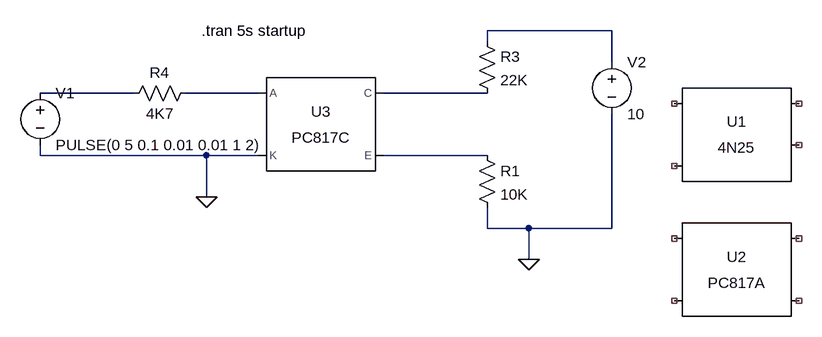
[diagram p0: schematic Draft1.asc]
Draft1.asc, the LTspice schematic file:
Version 4
SHEET 1 1096 680
WIRE 800 144 608 144
WIRE 608 160 608 144
WIRE 800 192 800 144
WIRE 64 240 -80 240
WIRE 256 240 144 240
WIRE 608 240 448 240
WIRE -80 336 -80 320
WIRE 176 336 -80 336
WIRE 256 336 176 336
WIRE 608 336 448 336
WIRE 176 400 176 336
WIRE 608 448 608 416
WIRE 672 448 608 448
WIRE 800 448 800 272
WIRE 800 448 672 448
WIRE 672 496 672 448
FLAG 176 400 0
FLAG 672 496 0
SYMBOL Optos/4N25 992 320 R0
SYMATTR InstName U1
SYMBOL voltage -80 224 R0
SYMATTR InstName V1
SYMATTR Value PULSE(0 5 0.1 0.01 0.01 1 2)
SYMBOL voltage 800 176 R0
SYMATTR InstName V2
SYMATTR Value 10
SYMBOL res 592 320 R0
SYMATTR InstName R1
SYMATTR Value 10K
SYMBOL res 592 144 R0
SYMATTR InstName R3
SYMATTR Value 22K
SYMBOL Res 160 224 R90
WINDOW 0 0 56 VBottom 2
WINDOW 3 32 56 VTop 2
SYMATTR InstName R4
SYMATTR Value 4K7
SYMBOL Optos/PC817A 992 512 R0
SYMATTR InstName U2
SYMBOL Optos/PC817C 352 288 R0
SYMATTR InstName U3
TEXT 168 144 Left 2 !.tran 5s startup

The netlist it stands for:
* Draft1.asc
XU1 NC_01 NC_02 NC_03 NC_04 NC_05 4N25
V1 N002 0 PULSE(0 5 0.1 0.01 0.01 1 2)
V2 N001 0 10
R1 N005 0 10K
R3 N001 N004 22K
R4 N003 N002 4K7
XU2 NC_06 NC_07 NC_08 NC_09 PC817 Igain=1m
XU3 N003 0 N004 N005 PC817 Igain=2.3m  ; PC817C, pins A K C E
.tran 5s startup
.lib 4N25.sub
.lib PC817.sub
.backanno
.end